# EAGLE schematic RGBNDR (EAGLE 8.4.1)
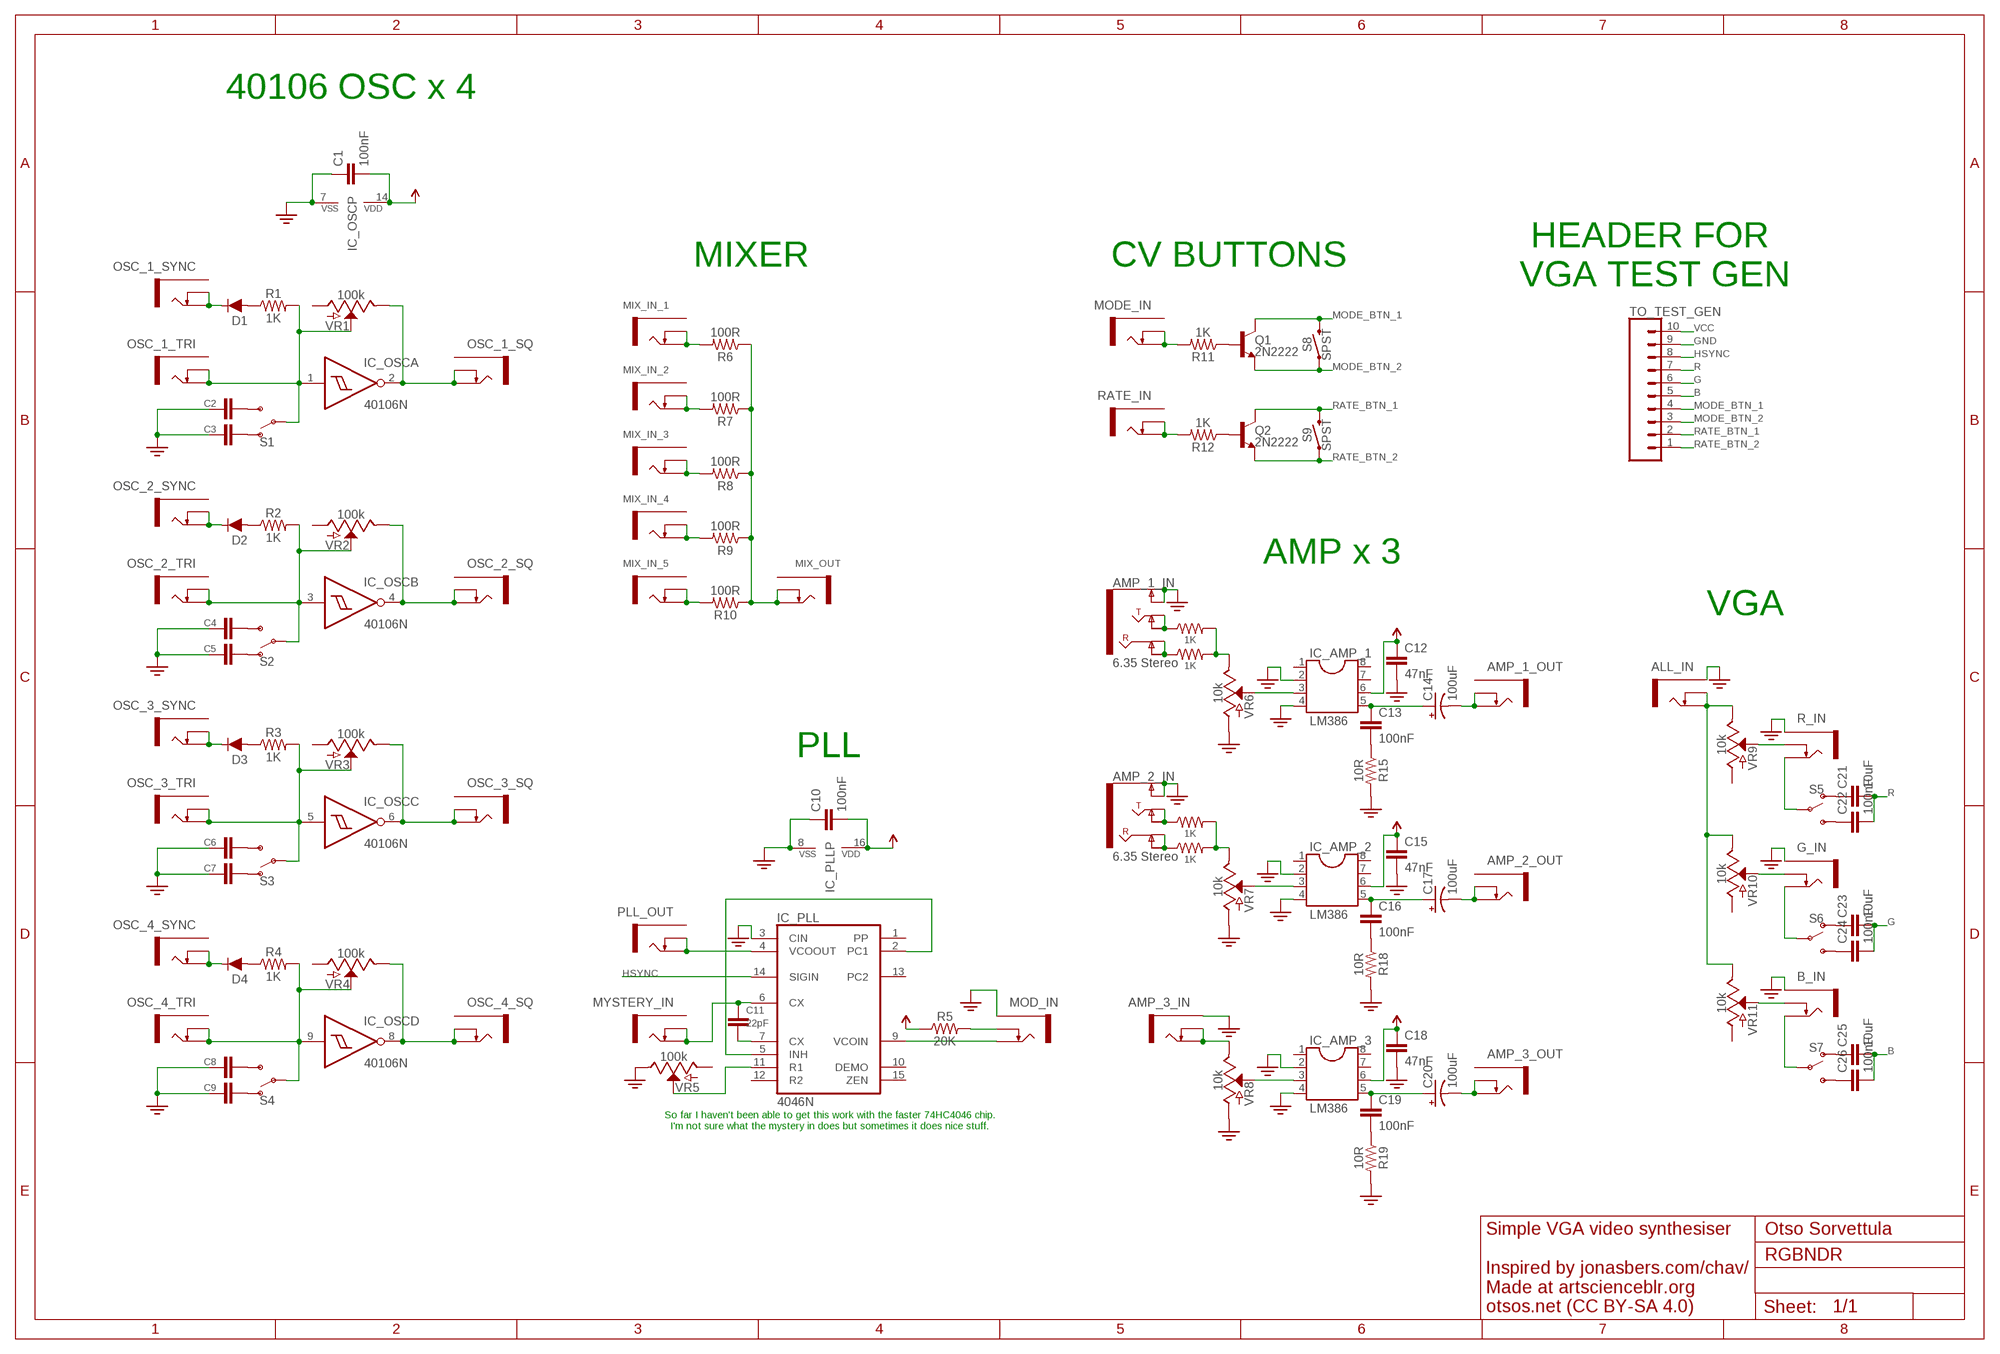
[diagram p0: schematic, sheet 1]

## Parts
ALL_IN  WQP-PJ301M-12_JACK  [WQP-PJ301M-12_JACK]
AMP_1_IN  6.35 Stereo  AUDIO_JACK_TRS_0.25"_PTH_RA  [AUDIO_JACK_0.25"_TRS_PTH_RA]
AMP_1_OUT  WQP-PJ301M-12_JACK  [WQP-PJ301M-12_JACK]
AMP_2_IN  6.35 Stereo  AUDIO_JACK_TRS_0.25"_PTH_RA  [AUDIO_JACK_0.25"_TRS_PTH_RA]
AMP_2_OUT  WQP-PJ301M-12_JACK  [WQP-PJ301M-12_JACK]
AMP_3_IN  WQP-PJ301M-12_JACK  [WQP-PJ301M-12_JACK]
AMP_3_OUT  WQP-PJ301M-12_JACK  [WQP-PJ301M-12_JACK]
B_IN  WQP-PJ301M-12_JACK  [WQP-PJ301M-12_JACK]
C1  100nF  0.1UF-KIT-EZ-50V-20%  [CAP-PTH-SMALL-KIT]
C2  0.1UF-KIT-EZ-50V-20%  [CAP-PTH-SMALL-KIT]
C3  0.1UF-KIT-EZ-50V-20%  [CAP-PTH-SMALL-KIT]
C4  0.1UF-KIT-EZ-50V-20%  [CAP-PTH-SMALL-KIT]
C5  0.1UF-KIT-EZ-50V-20%  [CAP-PTH-SMALL-KIT]
C6  0.1UF-KIT-EZ-50V-20%  [CAP-PTH-SMALL-KIT]
C7  0.1UF-KIT-EZ-50V-20%  [CAP-PTH-SMALL-KIT]
C8  0.1UF-KIT-EZ-50V-20%  [CAP-PTH-SMALL-KIT]
C9  0.1UF-KIT-EZ-50V-20%  [CAP-PTH-SMALL-KIT]
C10  100nF  0.1UF-KIT-EZ-50V-20%  [CAP-PTH-SMALL-KIT]
C11  22pF  22PF-PTH-2.54MM-200V-5%  [CAP-PTH-2.54]
C12  47nF  0.1UF-KIT-EZ-50V-20%  [CAP-PTH-SMALL-KIT]
C13  100nF  0.1UF-KIT-EZ-50V-20%  [CAP-PTH-SMALL-KIT]
C14  100uF  100UF-POLAR-RADIAL-2.5MM-25V-20%  [CPOL-RADIAL-2.5MM-6.5MM]
C15  47nF  0.1UF-KIT-EZ-50V-20%  [CAP-PTH-SMALL-KIT]
C16  100nF  0.1UF-KIT-EZ-50V-20%  [CAP-PTH-SMALL-KIT]
C17  100uF  100UF-POLAR-RADIAL-2.5MM-25V-20%  [CPOL-RADIAL-2.5MM-6.5MM]
C18  47nF  0.1UF-KIT-EZ-50V-20%  [CAP-PTH-SMALL-KIT]
C19  100nF  0.1UF-KIT-EZ-50V-20%  [CAP-PTH-SMALL-KIT]
C20  100uF  100UF-POLAR-RADIAL-2.5MM-25V-20%  [CPOL-RADIAL-2.5MM-6.5MM]
C21  10uF  0.1UF-KIT-EZ-50V-20%  [CAP-PTH-SMALL-KIT]
C22  100nF  0.1UF-KIT-EZ-50V-20%  [CAP-PTH-SMALL-KIT]
C23  10uF  0.1UF-KIT-EZ-50V-20%  [CAP-PTH-SMALL-KIT]
C24  100nF  0.1UF-KIT-EZ-50V-20%  [CAP-PTH-SMALL-KIT]
C25  10uF  0.1UF-KIT-EZ-50V-20%  [CAP-PTH-SMALL-KIT]
C26  100nF  0.1UF-KIT-EZ-50V-20%  [CAP-PTH-SMALL-KIT]
D1  DIODE-1N4148  [DIODE-1N4148]
D2  DIODE-1N4148  [DIODE-1N4148]
D3  DIODE-1N4148  [DIODE-1N4148]
D4  DIODE-1N4148  [DIODE-1N4148]
G_IN  WQP-PJ301M-12_JACK  [WQP-PJ301M-12_JACK]
IC_AMP_1  LM386  DIL8  [DIL08]
IC_AMP_2  LM386  DIL8  [DIL08]
IC_AMP_3  LM386  DIL8  [DIL08]
IC_OSC  40106N  [DIL14]
IC_PLL  4046N  [DIL16]
MIX_IN_1  WQP-PJ301M-12_JACK  [WQP-PJ301M-12_JACK]
MIX_IN_2  WQP-PJ301M-12_JACK  [WQP-PJ301M-12_JACK]
MIX_IN_3  WQP-PJ301M-12_JACK  [WQP-PJ301M-12_JACK]
MIX_IN_4  WQP-PJ301M-12_JACK  [WQP-PJ301M-12_JACK]
MIX_IN_5  WQP-PJ301M-12_JACK  [WQP-PJ301M-12_JACK]
MIX_OUT  WQP-PJ301M-12_JACK  [WQP-PJ301M-12_JACK]
MOD_IN  WQP-PJ301M-12_JACK  [WQP-PJ301M-12_JACK]
MODE_IN  WQP-PJ301M-12_JACK  [WQP-PJ301M-12_JACK]
MYSTERY_IN  WQP-PJ301M-12_JACK  [WQP-PJ301M-12_JACK]
OSC_1_SQ  WQP-PJ301M-12_JACK  [WQP-PJ301M-12_JACK]
OSC_1_SYNC  WQP-PJ301M-12_JACK  [WQP-PJ301M-12_JACK]
OSC_1_TRI  WQP-PJ301M-12_JACK  [WQP-PJ301M-12_JACK]
OSC_2_SQ  WQP-PJ301M-12_JACK  [WQP-PJ301M-12_JACK]
OSC_2_SYNC  WQP-PJ301M-12_JACK  [WQP-PJ301M-12_JACK]
OSC_2_TRI  WQP-PJ301M-12_JACK  [WQP-PJ301M-12_JACK]
OSC_3_SQ  WQP-PJ301M-12_JACK  [WQP-PJ301M-12_JACK]
OSC_3_SYNC  WQP-PJ301M-12_JACK  [WQP-PJ301M-12_JACK]
OSC_3_TRI  WQP-PJ301M-12_JACK  [WQP-PJ301M-12_JACK]
OSC_4_SQ  WQP-PJ301M-12_JACK  [WQP-PJ301M-12_JACK]
OSC_4_SYNC  WQP-PJ301M-12_JACK  [WQP-PJ301M-12_JACK]
OSC_4_TRI  WQP-PJ301M-12_JACK  [WQP-PJ301M-12_JACK]
PLL_OUT  WQP-PJ301M-12_JACK  [WQP-PJ301M-12_JACK]
Q1  2N2222  TRANS_NPN-P2N2222A  [TO-92]
Q2  2N2222  TRANS_NPN-P2N2222A  [TO-92]
R1  1K  10KOHM-HORIZ-1/4W-5%  [AXIAL-0.3]
R2  1K  10KOHM-HORIZ-1/4W-5%  [AXIAL-0.3]
R3  1K  10KOHM-HORIZ-1/4W-5%  [AXIAL-0.3]
R4  1K  10KOHM-HORIZ-1/4W-5%  [AXIAL-0.3]
R5  20K  10KOHM-HORIZ-1/4W-5%  [AXIAL-0.3]
R6  100R  10KOHM-HORIZ-1/4W-5%  [AXIAL-0.3]
R7  100R  10KOHM-HORIZ-1/4W-5%  [AXIAL-0.3]
R8  100R  10KOHM-HORIZ-1/4W-5%  [AXIAL-0.3]
R9  100R  10KOHM-HORIZ-1/4W-5%  [AXIAL-0.3]
R10  100R  10KOHM-HORIZ-1/4W-5%  [AXIAL-0.3]
R11  1K  10KOHM-HORIZ-1/4W-5%  [AXIAL-0.3]
R12  1K  10KOHM-HORIZ-1/4W-5%  [AXIAL-0.3]
R13  1K  10KOHM-HORIZ-1/4W-5%  [AXIAL-0.3]
R14  1K  10KOHM-HORIZ-1/4W-5%  [AXIAL-0.3]
R15  10R  10KOHM-HORIZ-1/4W-5%  [AXIAL-0.3]
R16  1K  10KOHM-HORIZ-1/4W-5%  [AXIAL-0.3]
R17  1K  10KOHM-HORIZ-1/4W-5%  [AXIAL-0.3]
R18  10R  10KOHM-HORIZ-1/4W-5%  [AXIAL-0.3]
R19  10R  10KOHM-HORIZ-1/4W-5%  [AXIAL-0.3]
R_IN  WQP-PJ301M-12_JACK  [WQP-PJ301M-12_JACK]
RATE_IN  WQP-PJ301M-12_JACK  [WQP-PJ301M-12_JACK]
S1  SWITCH-SPDT-PTH-11.6X4.0MM-LOCK  [SWITCH_SPDT_PTH_11.6X4.0MM_LOCK]
S2  SWITCH-SPDT-PTH-11.6X4.0MM-LOCK  [SWITCH_SPDT_PTH_11.6X4.0MM_LOCK]
S3  SWITCH-SPDT-PTH-11.6X4.0MM-LOCK  [SWITCH_SPDT_PTH_11.6X4.0MM_LOCK]
S4  SWITCH-SPDT-PTH-11.6X4.0MM-LOCK  [SWITCH_SPDT_PTH_11.6X4.0MM_LOCK]
S5  SWITCH-SPDT-PTH-11.6X4.0MM-LOCK  [SWITCH_SPDT_PTH_11.6X4.0MM_LOCK]
S6  SWITCH-SPDT-PTH-11.6X4.0MM-LOCK  [SWITCH_SPDT_PTH_11.6X4.0MM_LOCK]
S7  SWITCH-SPDT-PTH-11.6X4.0MM-LOCK  [SWITCH_SPDT_PTH_11.6X4.0MM_LOCK]
S8  SPST  MOMENTARY-SWITCH-SPST-PTH-6.0MM  [TACTILE_SWITCH_PTH_6.0MM]
S9  SPST  MOMENTARY-SWITCH-SPST-PTH-6.0MM  [TACTILE_SWITCH_PTH_6.0MM]
TO_TEST_GEN  CONN_10"  [1X10]
VR1  100k  POTENTIOMETER-PTH-9MM-1/20W-20%-KIT  [POT-PTH-ALPS-KIT]
VR2  100k  POTENTIOMETER-PTH-9MM-1/20W-20%-KIT  [POT-PTH-ALPS-KIT]
VR3  100k  POTENTIOMETER-PTH-9MM-1/20W-20%-KIT  [POT-PTH-ALPS-KIT]
VR4  100k  POTENTIOMETER-PTH-9MM-1/20W-20%-KIT  [POT-PTH-ALPS-KIT]
VR5  100k  POTENTIOMETER-PTH-9MM-1/20W-20%-KIT  [POT-PTH-ALPS-KIT]
VR6  10k  POTENTIOMETER-PTH-9MM-1/20W-20%-KIT  [POT-PTH-ALPS-KIT]
VR7  10k  POTENTIOMETER-PTH-9MM-1/20W-20%-KIT  [POT-PTH-ALPS-KIT]
VR8  10k  POTENTIOMETER-PTH-9MM-1/20W-20%-KIT  [POT-PTH-ALPS-KIT]
VR9  10k  POTENTIOMETER-PTH-9MM-1/20W-20%-KIT  [POT-PTH-ALPS-KIT]
VR10  10k  POTENTIOMETER-PTH-9MM-1/20W-20%-KIT  [POT-PTH-ALPS-KIT]
VR11  10k  POTENTIOMETER-PTH-9MM-1/20W-20%-KIT  [POT-PTH-ALPS-KIT]

## Nets
B: C25.2 C26.2 TO_TEST_GEN.5
G: C23.2 C24.2 TO_TEST_GEN.6
GND: ALL_IN.P$1 AMP_1_IN.SLEEVE(EARTH) AMP_1_IN.SLEEVE-NORM(EARTH-NORM) AMP_2_IN.SLEEVE(EARTH) AMP_2_IN.SLEEVE-NORM(EARTH-NORM) AMP_3_IN.P$1 B_IN.P$1 C1.1 C2.2 C3.2 C4.2 C5.2 C6.2 C7.2 C8.2 C9.2 C10.1 C12.2 C15.2 C18.2 G_IN.P$1 IC_AMP_1.2 IC_AMP_1.4 IC_AMP_2.2 IC_AMP_2.4 IC_AMP_3.2 IC_AMP_3.4 IC_OSC.7(P:VSS) IC_PLL.3(CIN) IC_PLL.8(VSS) MOD_IN.P$1 R15.P$2 R18.P$2 R19.P$2 R_IN.P$1 TO_TEST_GEN.9 VR5.P$1(E) VR6.P$3(A) VR7.P$3(A) VR8.P$3(A)
HSYNC: IC_PLL.14(SIGIN) TO_TEST_GEN.8
MODE_BTN_1: Q1.1(C) S8.3 TO_TEST_GEN.4
MODE_BTN_2: Q1.3(E) S8.1 TO_TEST_GEN.3
N$1: IC_PLL.2(PC1) IC_PLL.5(INH)
N$2: C11.1 IC_PLL.6(CX) MYSTERY_IN.P$2 MYSTERY_IN.P$3
N$3: C11.2 IC_PLL.7(CX)
N$4: MIX_IN_1.P$2 MIX_IN_1.P$3 R6.P$2
N$5: MIX_IN_2.P$2 MIX_IN_2.P$3 R7.P$2
N$6: MIX_IN_3.P$2 MIX_IN_3.P$3 R8.P$2
N$7: MIX_IN_4.P$2 MIX_IN_4.P$3 R9.P$2
N$8: IC_AMP_1.3 VR6.P$2(S)
N$9: C13.2 R15.P$1
N$10: MIX_IN_5.P$2 MIX_IN_5.P$3 R10.P$2
N$11: MIX_OUT.P$2 MIX_OUT.P$3 R6.P$1 R7.P$1 R8.P$1 R9.P$1 R10.P$1
N$12: C13.1 C14.1(+) IC_AMP_1.5
N$13: ALL_IN.P$2 ALL_IN.P$3 VR9.P$1(E) VR10.P$1(E) VR11.P$1(E)
N$14: D2.A R2.P$1
N$15: R_IN.P$3 VR9.P$2(S)
N$16: R_IN.P$2 S5.2(P)
N$17: IC_OSC.2(A:O) OSC_1_SQ.P$2 OSC_1_SQ.P$3 VR1.P$1(E)
N$18: D2.C OSC_2_SYNC.P$2 OSC_2_SYNC.P$3
N$19: IC_OSC.4(B:O) OSC_2_SQ.P$2 OSC_2_SQ.P$3 VR2.P$1(E)
N$20: IC_OSC.3(B:I) OSC_2_TRI.P$2 OSC_2_TRI.P$3 R2.P$2 S2.2(P) VR2.P$2(S)
N$21: C4.1 S2.3(S)
N$22: C22.1 S5.3(S)
N$23: C21.1 S5.1(O)
N$24: G_IN.P$3 VR10.P$2(S)
N$25: G_IN.P$2 S6.2(P)
N$26: C24.1 S6.3(S)
N$27: C23.1 S6.1(O)
N$28: R13.P$2 R14.P$2 VR6.P$1(E)
N$29: D1.C OSC_1_SYNC.P$2 OSC_1_SYNC.P$3
N$30: D1.A R1.P$1
N$31: IC_OSC.1(A:I) OSC_1_TRI.P$2 OSC_1_TRI.P$3 R1.P$2 S1.2(P) VR1.P$2(S)
N$32: C2.1 S1.3(S)
N$33: C3.1 S1.1(O)
N$34: C5.1 S2.1(O)
N$35: D3.A R3.P$1
N$36: D3.C OSC_3_SYNC.P$2 OSC_3_SYNC.P$3
N$37: IC_OSC.6(C:O) OSC_3_SQ.P$2 OSC_3_SQ.P$3 VR3.P$1(E)
N$38: IC_OSC.5(C:I) OSC_3_TRI.P$2 OSC_3_TRI.P$3 R3.P$2 S3.2(P) VR3.P$2(S)
N$39: C6.1 S3.3(S)
N$40: C7.1 S3.1(O)
N$41: D4.A R4.P$1
N$42: D4.C OSC_4_SYNC.P$2 OSC_4_SYNC.P$3
N$43: IC_OSC.8(D:O) OSC_4_SQ.P$2 OSC_4_SQ.P$3 VR4.P$1(E)
N$44: IC_OSC.9(D:I) OSC_4_TRI.P$2 OSC_4_TRI.P$3 R4.P$2 S4.2(P) VR4.P$2(S)
N$45: C8.1 S4.3(S)
N$46: C9.1 S4.1(O)
N$47: IC_PLL.11(R1) VR5.P$2(S)
N$48: MOD_IN.P$3 R5.P$2
N$49: IC_PLL.9(VCOIN) MOD_IN.P$2
N$50: AMP_1_IN.TIP AMP_1_IN.TIP-NORM R13.P$1
N$51: AMP_1_IN.RING AMP_1_IN.RING-NORM R14.P$1
N$52: AMP_1_OUT.P$2 AMP_1_OUT.P$3 C14.2(-)
N$53: IC_AMP_2.3 VR7.P$2(S)
N$54: C16.2 R18.P$1
N$55: C16.1 C17.1(+) IC_AMP_2.5
N$56: AMP_2_IN.TIP AMP_2_IN.TIP-NORM R16.P$1
N$57: AMP_2_IN.RING AMP_2_IN.RING-NORM R17.P$1
N$58: R16.P$2 R17.P$2 VR7.P$1(E)
N$59: AMP_2_OUT.P$2 AMP_2_OUT.P$3 C17.2(-)
N$60: IC_AMP_3.3 VR8.P$2(S)
N$61: C19.2 R19.P$1
N$62: C19.1 C20.1(+) IC_AMP_3.5
N$63: B_IN.P$3 VR11.P$2(S)
N$64: B_IN.P$2 S7.2(P)
N$65: AMP_3_IN.P$2 AMP_3_IN.P$3 VR8.P$1(E)
N$66: AMP_3_OUT.P$2 AMP_3_OUT.P$3 C20.2(-)
N$67: C26.1 S7.3(S)
N$68: C25.1 S7.1(O)
N$69: Q1.2(B) R11.P$1
N$70: MODE_IN.P$2 MODE_IN.P$3 R11.P$2
N$71: Q2.2(B) R12.P$1
N$72: R12.P$2 RATE_IN.P$2 RATE_IN.P$3
PLL_OUT: IC_PLL.4(VCOOUT) PLL_OUT.P$2 PLL_OUT.P$3
R: C21.2 C22.2 TO_TEST_GEN.7
RATE_BTN_1: Q2.1(C) S9.3 TO_TEST_GEN.2
RATE_BTN_2: Q2.3(E) S9.1 TO_TEST_GEN.1
VCC: C1.2 C10.2 C12.1 C15.1 C18.1 IC_AMP_1.6 IC_AMP_2.6 IC_AMP_3.6 IC_OSC.14(P:VDD) IC_PLL.16(VDD) R5.P$1 TO_TEST_GEN.10
Unconnected: AMP_1_OUT.P$1 AMP_2_OUT.P$1 AMP_3_OUT.P$1 IC_AMP_1.1 IC_AMP_1.7 IC_AMP_1.8 IC_AMP_2.1 IC_AMP_2.7 IC_AMP_2.8 IC_AMP_3.1 IC_AMP_3.7 IC_AMP_3.8 IC_OSC.10(E:O) IC_OSC.11(E:I) IC_OSC.12(F:O) IC_OSC.13(F:I) IC_PLL.1(PP) IC_PLL.10(DEMO) IC_PLL.12(R2) IC_PLL.13(PC2) IC_PLL.15(ZEN) MIX_IN_1.P$1 MIX_IN_2.P$1 MIX_IN_3.P$1 MIX_IN_4.P$1 MIX_IN_5.P$1 MIX_OUT.P$1 MODE_IN.P$1 MYSTERY_IN.P$1 OSC_1_SQ.P$1 OSC_1_SYNC.P$1 OSC_1_TRI.P$1 OSC_2_SQ.P$1 OSC_2_SYNC.P$1 OSC_2_TRI.P$1 OSC_3_SQ.P$1 OSC_3_SYNC.P$1 OSC_3_TRI.P$1 OSC_4_SQ.P$1 OSC_4_SYNC.P$1 OSC_4_TRI.P$1 PLL_OUT.P$1 RATE_IN.P$1 VR1.P$3(A) VR2.P$3(A) VR3.P$3(A) VR4.P$3(A) VR5.P$3(A) VR9.P$3(A) VR10.P$3(A) VR11.P$3(A)

## Notes on the sheet
- 40106 OSC x 4
- MIXER | CV BUTTONS
- HEADER FOR 
  VGA TEST GEN
- AMP x 3
- VGA
- PLL
- So far I haven't been able to get this work with the faster 74HC4046 chip.
  I'm not sure what the mystery in does but sometimes it does nice stuff.
- Simple VGA video synthesiser
  
  Inspired by jonasbers.com/chav/
  Made at artscienceblr.org
  otsos.net (CC BY-SA 4.0)
- Otso Sorvettula

## Library data of the parts
ALL_IN AMP_1_OUT AMP_2_OUT AMP_3_IN AMP_3_OUT B_IN G_IN MIX_IN_1-MIX_IN_5 MIX_OUT MOD_IN MODE_IN MYSTERY_IN OSC_1_SQ OSC_1_SYNC OSC_1_TRI OSC_2_SQ OSC_2_SYNC OSC_2_TRI OSC_3_SQ OSC_3_SYNC OSC_3_TRI OSC_4_SQ OSC_4_SYNC OSC_4_TRI PLL_OUT R_IN RATE_IN = thonkiconn:WQP-PJ301M-12_JACK
AMP_1_IN AMP_2_IN = SparkFun-Connectors:AUDIO_JACK_TRS_0.25"_PTH_RA: Audio Jack, 1/4" TRS jack, horizontal, PTH, aka "Phono jack" Find the connector here: Audio Jack - 1/4" Stereo (right angle) <https://www.sparkfun.com/products/11144> (COM-11144) Datasheet <http://cdn.sparkfun.com/datasheets/Components/General/JP-611%20DD.jpg> Note, although the datasheet and physical part are slightly different, this footprint was proven to mate well on the Proto Pedal. This device is used on these SparkFun Products: SparkFun TRS Jack Breakout - 1/4" Stereo <https://www.sparkfun.com/products/13005> (BOB-13005 ) SparkFun Proto Pedal - sorry bad link - product comming soon! <https://www.sparkfun.com/products/13124> (PRT-13124); PROD_ID: CONN-12339; SF_ID: COM-11144
C1-C10 C12 C13 C15 C16 C18 C19 C21-C26 = SparkFun-Capacitors:0.1UF: 0.1µF ceramic capacitors A capacitor is a passive two-terminal electrical component used to store electrical energy temporarily in an electric field.; PROD_ID: CAP-08370; VALUE: 0.1uF
C11 = SparkFun-Capacitors:22PF: 22pF ceramic capacitors A capacitor is a passive two-terminal electrical component used to store electrical energy temporarily in an electric field.; PROD_ID: CAP-09128
C14 C17 C20 = SparkFun-Capacitors:100UF-POLAR: 100µF polarized capacitors A capacitor is a passive two-terminal electrical component used to store electrical energy temporarily in an electric field.; PROD_ID: CAP-08439
D1-D4 = SparkFun-DiscreteSemi:DIODE: Diode These are standard reverse protection diodes and small signal diodes. SparkFun Products: SparkFun SparkPunk Sound Kit <https://www.sparkfun.com/products/11177> SparkFun ESP8266 Thing <https://www.sparkfun.com/products/13231>; PROD_ID: DIO-08378; VALUE: 200mA/100V/1V
IC_AMP_1-IC_AMP_3 = ic-package:DIL8: Dual In Line / Socket
IC_OSC = 40xx:40106: Hex SCHMITT TRIGGER
IC_PLL = 40xx:4046: Micropower PLL
Q1 Q2 = SparkFun-DiscreteSemi:TRANS_NPN: NPN transistor Current controlled devices typically used to amplify current or used as a switch. BC547 - COM-08928 <http://www.sparkfun.com/products/8928> (TO-92 45V 100mA) (1.Collector 2.Base 3.Emitter) 2N3904 - COM-00521 <http://www.sparkfun.com/products/521> (TO-92 40V 200mA) (1.Emitter 2.Base 3.Collector) P2N2222A - COM-12852 <http://www.sparkfun.com/products/12852> (TO-92 40V 600mA) (1.Collector 2.Base 3.Emitter); PROD_ID: TRANS-09536; VALUE: 600mA/40V
R1-R19 = SparkFun-Resistors:10KOHM: 10kΩ resistor A resistor is a passive two-terminal electrical component that implements electrical resistance as a circuit element. Resistors act to reduce current flow, and, at the same time, act to lower voltage levels within circuits. - Wikipedia; PROD_ID: RES-09435; VALUE: 10k
S1-S7 = SparkFun-Switches:SWITCH-SPDT: Single Pole, Double Throw (SPDT) Switch Single-pole, double-throw (SPDT) switch. Variant Overview SMD-AYZ0202 Surface Mount DPDT Switch <https://www.sparkfun.com/products/597> (COM-00597) Used on e.g. LilyPad Arduino USB - ATmega32U4 Board <https://www.sparkfun.com/products/12049> PTH-11.6X4.0MM SPDT Mini Power Switch <https://www.sparkfun.com/products/102> (COM-00102) Used on e.g. SparkFun Simon Says - Through-Hole Soldering Kit <https://www.sparkfun.com/products/10547> (KIT-10547) PTH-11.6X4.0MM-KIT KIT version of SPDT Mini Power Switch - Simplifies soldering by removing tStop of switch pins - only one side can be soldered. PTH-11.6X4.0MM-LOCK LOCK version of SPDT Mini Power Switch - Offset pins hold switch in place for easier soldering. SMD-RIGHT-ANGLE Surface Mount Right Angle Switch <https://www.sparkfun.com/products/10860> (COM-10860) Used on e.g. SparkFun ESP8266 Thing <https://www.sparkfun.com/products/13231>; PROD_ID: SWCH-08261; SF_SKU: COM-00102
S8 S9 = SparkFun-Switches:MOMENTARY-SWITCH-SPST: Momentary Switch (Pushbutton) - SPST Normally-open (NO) SPST momentary switches (buttons, pushbuttons). Variants PTH-12MM - 12mm square, through-hole Momentary Pushbutton Switch - 12mm Square <https://www.sparkfun.com/products/9190> (COM-09190) PTH-6.0MM, PTH-6.0MM-KIT - 6.0mm square, through-hole Mini Pushbutton Switch <https://www.sparkfun.com/products/97> (COM-00097) KIT package intended for soldering kit's - only one side of pads' copper is exposed. PTH-RIGHT-ANGLE-KIT - Right-angle, through-hole Right Angle Tactile Button <https://www.sparkfun.com/products/10791> - Used on SparkFun BigTime Watch Kit <https://www.sparkfun.com/products/11734> SMD-12MM - 12mm square, surface-mount Tactile Button - SMD (12mm) <https://www.sparkfun.com/products/12993> (COM-12993) Used on SparkFun PicoBoard <https://www.sparkfun.com/products/11888> SMD-4.5MM - 4.5mm Square Trackball Switch Used on SparkFun Blackberry Trackballer Breakout <https://www.sparkfun.com/products/13169> SMD-4.6MMX2.8MM - 4.60mm x 2.80mm, surface mount Used on SparkFun SAMD21 Mini Breakout <https://www.sparkfun.com/products/13664> SMD-5.2MM, SMD-5.2-REDUNDANT - 5.2mm square, surface-mount Mini Pushbutton Switch - SMD <https://www.sparkfun.com/products/8720> (COM-08720) Used on Arduino Pro Mini <https://www.sparkfun.com/products/11114> REDUNDANT package connects both switch circuits together SMD-6.0X3.5MM - 6.0 x 3.5mm, surface mount Momentary Reset Switch SMD <https://www.sparkfun.com/products/8229> (COM-08229) SMD-6.2MM-TALL - 6.2mm square, surface mount Tactile Button - SMD (6mm) <https://www.sparkfun.com/products/12992> Used on SparkFun Digital Sandbox <https://www.sparkfun.com/products/12651> SMD-RIGHT-ANGLE - Right-angle, surface mount Used on SparkFun Block for Intel® Edison - Arduino <https://www.sparkfun.com/products/13036>; PROD_ID: SWCH-08441; SF_SKU: COM-00097
TO_TEST_GEN = SparkFun-Connectors:CONN_10: Multi connection point. Often used as Generic Header-pin footprint for 0.1 inch spaced/style header connections On any of the 0.1 inch spaced packages, you can populate with these: Break Away Headers - Straight <https://www.sparkfun.com/products/116> (PRT-00116) Break Away Male Headers - Right Angle <https://www.sparkfun.com/products/553> (PRT-00553) Female Headers <https://www.sparkfun.com/products/115> (PRT-00115) Break Away Headers - Machine Pin <https://www.sparkfun.com/products/117> (PRT-00117) Break Away Female Headers - Swiss Machine Pin <https://www.sparkfun.com/products/743> (PRT-00743) Arduino Stackable Header - 10 Pin <https://www.sparkfun.com/products/11376> (PRT-11376) For SCREWTERMINALS and SPRING TERMINALS visit here: Screw Terimnals on SparkFun.com <https://www.sparkfun.com/search/results?term=Screw+Terminals> (5mm/3.5mm/2.54mm spacing) This device is also useful as a general connection point to wire up your design to another part of your project. Our various solder wires solder well into these plated through hole pads. Hook-Up Wire - Assortment (Stranded, 22 AWG) <https://www.sparkfun.com/products/11375> (PRT-11375) Hook-Up Wire - Assortment (Solid Core, 22 AWG) <https://www.sparkfun.com/products/11367> (PRT-11367) View the entire wire category on our website here <https://www.sparkfun.com/categories/141> Special notes: Molex polarized connector foot print use with SKU : PRT-08231 with associated crimp pins and housings. 1MM SMD Version SKU: PRT-10208 NOTES ON THE VARIANTS LOCK and LOCK_LONGPADS... This footprint was designed to help hold the alignment of a through-hole component (i.e. 6-pin header) while soldering it into place. You may notice that each hole has been shifted either up or down by 0.005 of an inch from it's more standard position (which is a perfectly straight line). This slight alteration caused the pins (the squares in the middle) to touch the edges of the holes. Because they are alternating, it causes a "brace" to hold the component in place. 0.005 has proven to be the perfect amount of "off-center" position when using our standard breakaway headers. Although looks a little odd when you look at the bare footprint, once you have a header in there, the alteration is very hard to notice. Also,if you push a header all the way into place, it is covered up entirely on the bottom side.; PROD_ID: CONN-11563
VR1-VR5 = SparkFun-Resistors:POTENTIOMETER: Potentiometer (Pot) Three-terminal potentiometers, with an adjustable wiper and two adjustable resistors. A pot can be used to create a configurable voltage divider, or as a variable resistor. Variants ALPS_POT and ALPS_POT_KIT - PTH, breadboard compatible, 9mm square pots Rotary Potentiometer - Linear (10k ohm) <https://www.sparkfun.com/products/9288> (COM-09288) The KIT variant exposes copper on only one side of the PTH pad, so the part can only be assembled on one side of the PCB. Useful for beginner soldering kits.; PROD_ID: RES-09177; SF_SKU: COM-09288; VALUE: 10k
VR6-VR11 = SparkFun-Resistors:POTENTIOMETER: Potentiometer (Pot) Three-terminal potentiometers, with an adjustable wiper and two adjustable resistors. A pot can be used to create a configurable voltage divider, or as a variable resistor. Variants ALPS_POT and ALPS_POT_KIT - PTH, breadboard compatible, 9mm square pots Rotary Potentiometer - Linear (10k ohm) <https://www.sparkfun.com/products/9288> (COM-09288) The KIT variant exposes copper on only one side of the PTH pad, so the part can only be assembled on one side of the PCB. Useful for beginner soldering kits.; PROD_ID: RES-09177; SF_SKU: COM-09288